# Altium schematic sheet MAIN.SchDoc: Voodoo Magic
size 431 x 279 mm; CheckedBy: Wuji Zhang & Chen Chen; Author: Wuji Zhang & Chen Chen; CompanyName: Upenn; DrawnBy: Wuji Zhang & Chen Chen; Engineer: Wuji Zhang & Chen Chen; Organization: ORGANIZATION; Address1: ADDRESS 1; Address2: ADDRESS 2; Address3: ADDRESS 3; Address4: ADDRESS 4; Revision: -; SheetNumber: 1; SheetTotal: 8; Title2: Main; Project: ESE516; ENG_APP_DATE: --/--/--; DSN_APP_DATE: --/--/--; CHK_APP_DATE: --/--/--
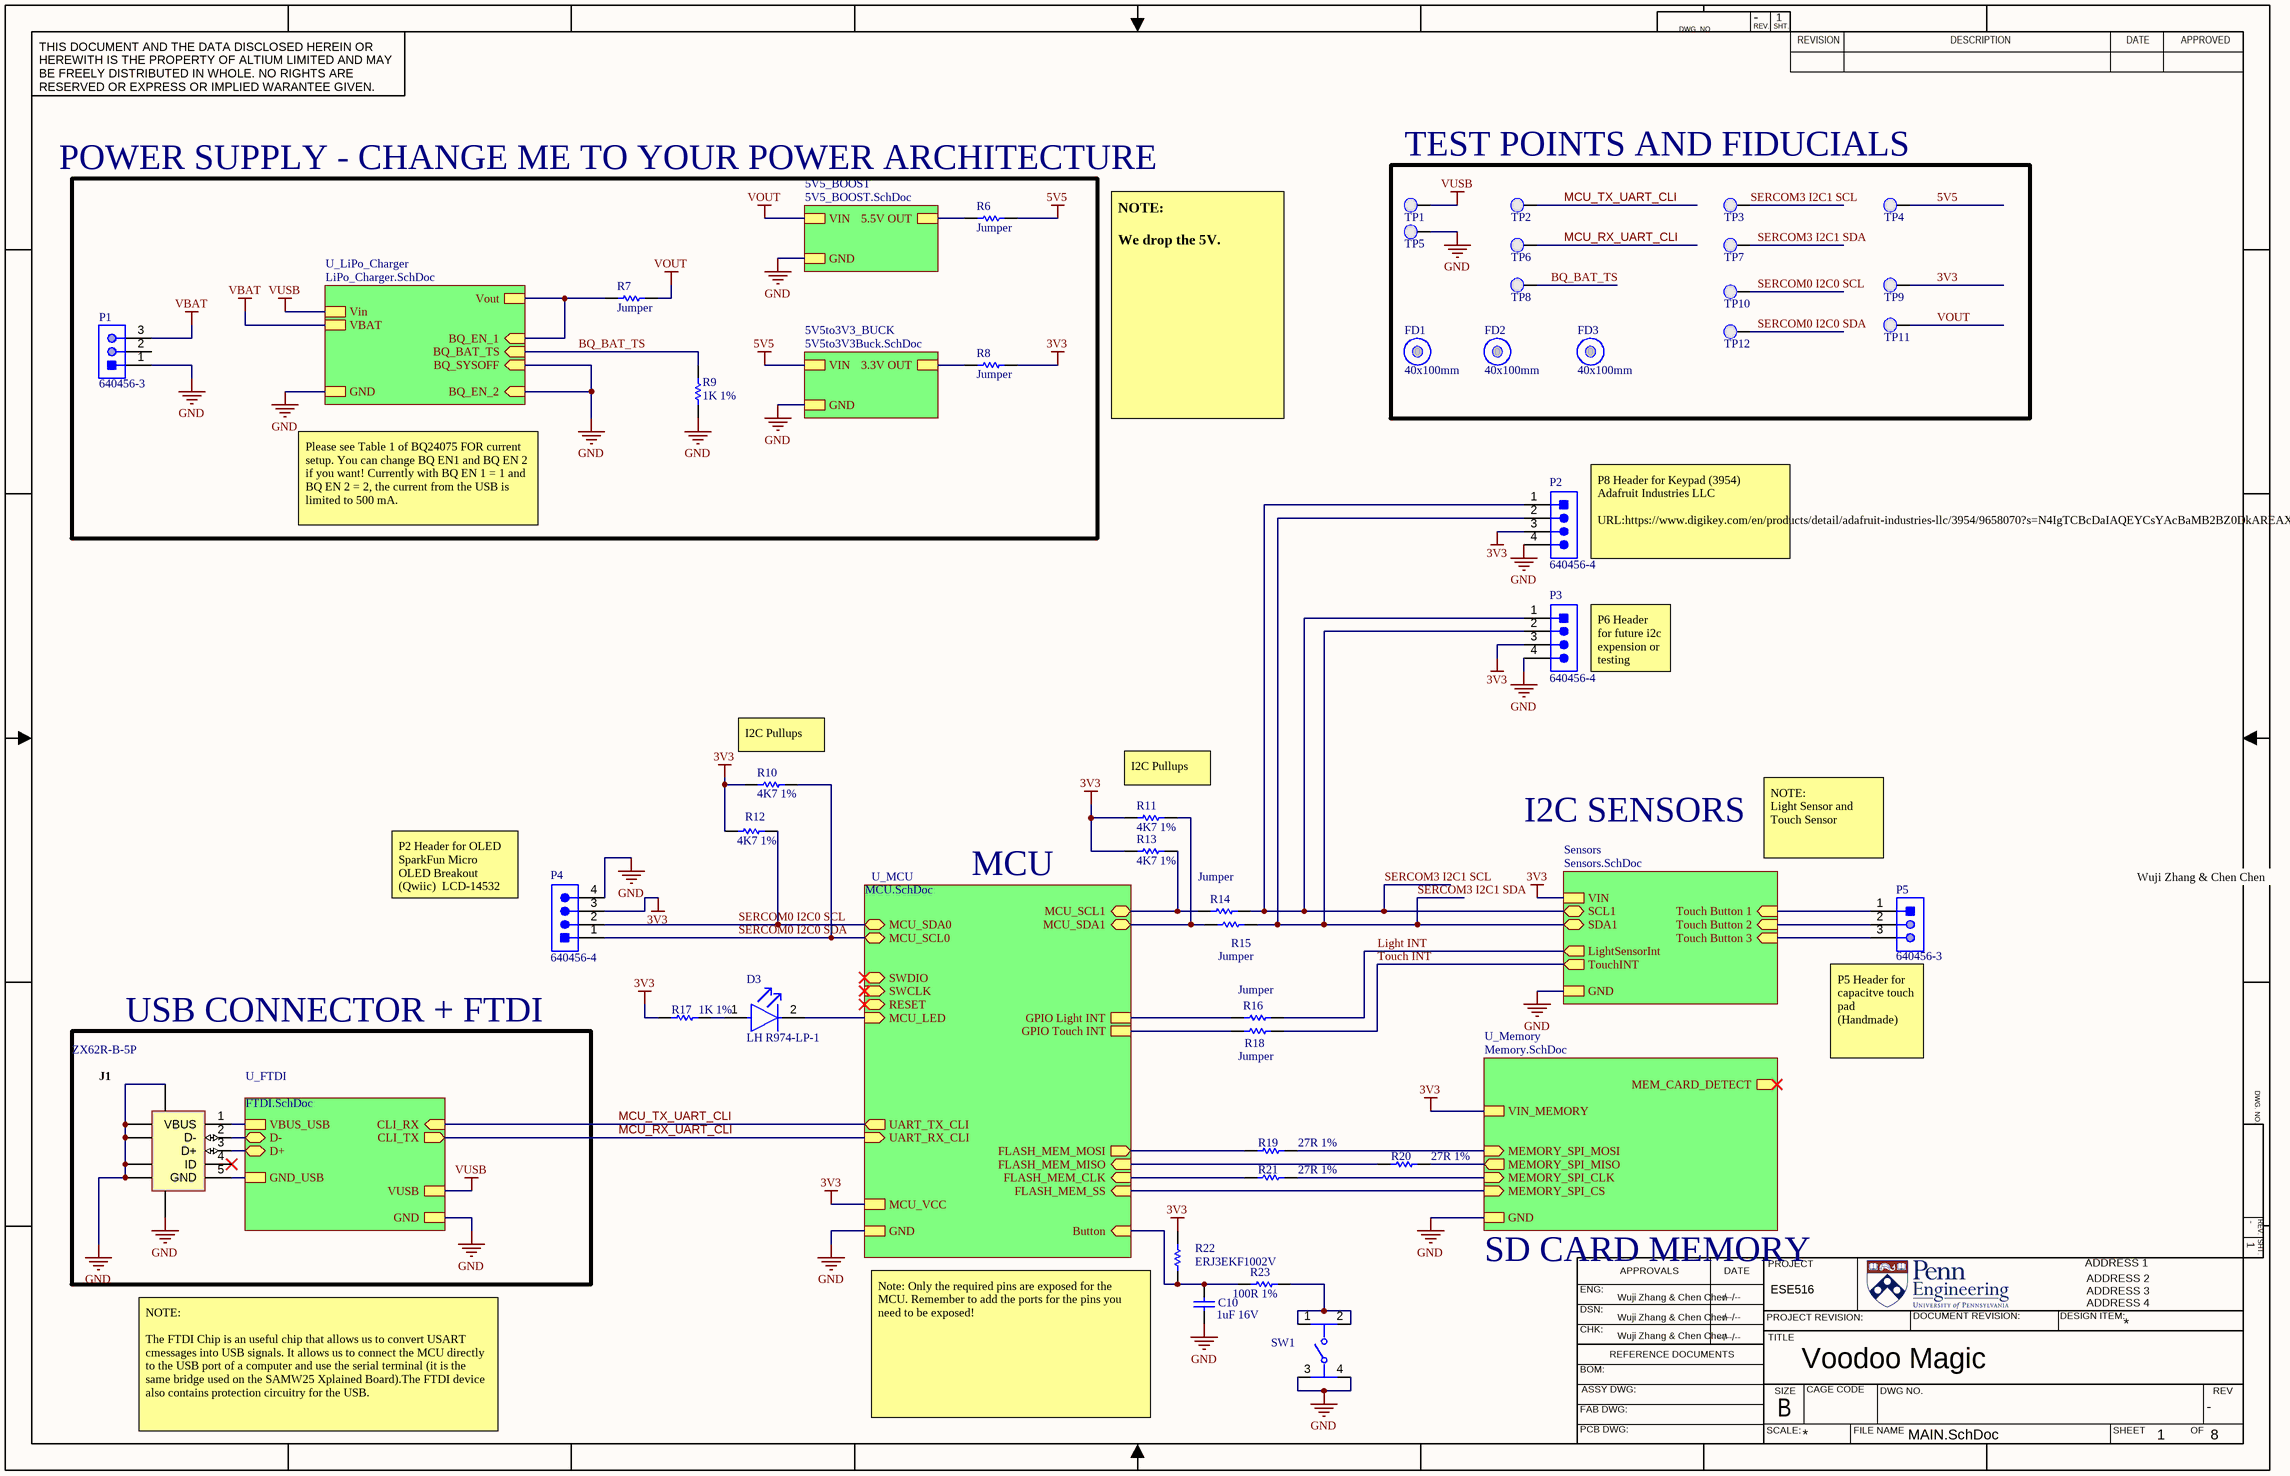
[diagram p0: MAIN.SchDoc]

## Parts
C10  1uF 16V  [CAPC0603(1608)100_N]
D3  LH R974-LP-1  [FP-LH_R974-MFG]
FD1  40x100mm  [Fiducial_FT]
FD2  40x100mm  [Fiducial_FT]
FD3  40x100mm  [Fiducial_FT]
J1  ZX62R-B-5P  [HIRO-ZX62R-B-5P_V]
P1  640456-3  [TECO-640456-3]
P2  640456-4  [TECO-640456-4]
P3  640456-4  [TECO-640456-4]
P4  640456-4  [TECO-640456-4]
P5  640456-3  [TECO-640456-3]
R6  Jumper  [RESC0805(2012)_N]
R7  Jumper  [RESC0805(2012)_N]
R8  Jumper  [RESC0805(2012)_N]
R9  1K 1%  [RESC0603(1608)_N]
R10  4K7 1%  [RESC0402(1005)_N]
R11  4K7 1%  [RESC0402(1005)_N]
R12  4K7 1%  [RESC0402(1005)_N]
R13  4K7 1%  [RESC0402(1005)_N]
R14  Jumper  [RESC0805(2012)_N]
R15  Jumper  [RESC0805(2012)_N]
R16  Jumper  [RESC0805(2012)_N]
R17  1K 1%  [RESC0603(1608)_N]
R18  Jumper  [RESC0805(2012)_N]
R19  27R 1%  [RESC0603(1608)_N]
R20  27R 1%  [RESC0603(1608)_N]
R21  27R 1%  [RESC0603(1608)_N]
R22  ERJ3EKF1002V  [RESC1609X55X30LL15T15]
R23  100R 1%  [RESC0603(1608)_N]
SW1  PTS810 SJG 250 SMTR LFS  [FP-PTS810_SJG_250_SMTR_LF-MFG]  (value not drawn)
TP1  0.1" Pad  [PCBComponent]  (value not drawn)
TP2  0.1" Pad  [PCBComponent]  (value not drawn)
TP3  0.1" Pad  [PCBComponent]  (value not drawn)
TP4  0.1" Pad  [PCBComponent]  (value not drawn)
TP5  0.1" Pad  [PCBComponent]  (value not drawn)
TP6  0.1" Pad  [PCBComponent]  (value not drawn)
TP7  0.1" Pad  [PCBComponent]  (value not drawn)
TP8  0.1" Pad  [PCBComponent]  (value not drawn)
TP9  0.1" Pad  [PCBComponent]  (value not drawn)
TP10  0.1" Pad  [PCBComponent]  (value not drawn)
TP11  0.1" Pad  [PCBComponent]  (value not drawn)
TP12  0.1" Pad  [PCBComponent]  (value not drawn)

## Blocks framed on the sheet
TEST POINTS AND FIDUCIALS: FD1-FD3 TP1-TP12
USB CONNECTOR + FTDI: J1

## Sub-sheets
5V5_BOOST = 5V5_BOOST.SchDoc: VIN, 5.5V OUT, GND
5V5to3V3_BUCK = 5V5to3V3Buck.SchDoc: VIN, 3.3V OUT, GND
Sensors = Sensors.SchDoc: VIN, SCL1 (bidir), SDA1 (bidir), TouchINT (out), LightSensorInt (out), GND, Touch Button 1 (in), Touch Button 2 (in), Touch Button 3 (in)
U_FTDI = FTDI.SchDoc: CLI_RX (in), CLI_TX (out), VUSB, GND, VBUS_USB, D- (bidir), D+ (bidir), GND_USB
U_LiPo_Charger = LiPo_Charger.SchDoc: BQ_EN_2 (in), BQ_SYSOFF (in), BQ_EN_1 (in), BQ_BAT_TS (in), Vin, Vout, GND, VBAT
U_MCU = MCU.SchDoc: SWDIO (bidir), SWCLK (in), UART_TX_CLI (out), UART_RX_CLI (in), FLASH_MEM_SS (in), FLASH_MEM_CLK (in), FLASH_MEM_MISO (in), FLASH_MEM_MOSI (out), RESET (bidir), MCU_LED (in), MCU_VCC, GND, MCU_SCL1 (bidir), MCU_SDA1 (bidir), GPIO Light INT, GPIO Touch INT, Button (in), MCU_SCL0 (bidir), MCU_SDA0 (bidir)
U_Memory = Memory.SchDoc: MEMORY_SPI_MOSI (in), MEMORY_SPI_MISO (out), MEMORY_SPI_CLK (in), MEMORY_SPI_CS (in), MEM_CARD_DETECT (out), VIN_MEMORY, GND

## Nets
3V3: P2.3 P3.3 P4.3 R8.2 R10.2 R11.2 R12.2 R13.2 R17.1 R22.2 TP9.1(PAD) ; sheet U_MCU/MCU_VCC, sheet U_Memory/VIN_MEMORY, sheet Sensors/VIN
5V5: R6.2 TP4.1(PAD) ; sheet 5V5to3V3_BUCK/VIN
GND: C10.1 J1.6(SHLD) J1.7(SHLD) J1.8(SHLD) J1.9(SHLD) J1.10(SHLD) J1.11(SHLD) P1.1 P2.4 P3.4 P4.4 R9.2 SW1.3 SW1.4 TP5.1(PAD) ; sheet U_FTDI/GND, sheet U_MCU/GND, sheet U_Memory/GND, sheet U_LiPo_Charger/BQ_EN_2, sheet U_LiPo_Charger/BQ_SYSOFF, sheet U_LiPo_Charger/GND, sheet 5V5_BOOST/GND, sheet 5V5to3V3_BUCK/GND, sheet Sensors/GND
VBAT: P1.3 ; sheet U_LiPo_Charger/VBAT
VOUT: R7.2 TP11.1(PAD) ; sheet 5V5_BOOST/VIN
VUSB: TP1.1(PAD) ; sheet U_FTDI/VUSB, sheet U_LiPo_Charger/Vin
BQ_BAT_TS: R9.1 TP8.1(PAD) ; sheet U_LiPo_Charger/BQ_BAT_TS
Light INT: R16.2 ; sheet Sensors/LightSensorInt
MCU_RX_UART_CLI: TP6.1(PAD) ; sheet U_FTDI/CLI_TX, sheet U_MCU/UART_RX_CLI
MCU_TX_UART_CLI: TP2.1(PAD) ; sheet U_FTDI/CLI_RX, sheet U_MCU/UART_TX_CLI
SERCOM0 I2C0 SCL: P4.2 R12.1 TP10.1(PAD) ; sheet U_MCU/MCU_SDA0
SERCOM0 I2C0 SDA: P4.1 R10.1 TP12.1(PAD) ; sheet U_MCU/MCU_SCL0
SERCOM3 I2C1 SCL: P2.1 P3.1 R14.2 TP3.1(PAD) ; sheet Sensors/SCL1
SERCOM3 I2C1 SDA: P2.2 P3.2 R15.2 TP7.1(PAD) ; sheet Sensors/SDA1
Touch INT: R18.2 ; sheet Sensors/TouchINT
NetC10_2: C10.2 R22.1 R23.1 ; sheet U_MCU/Button
NetD3_1: D3.1(A) R17.2
NetD3_2: D3.2(C) ; sheet U_MCU/MCU_LED
NetJ1_1: J1.1(VBUS) ; sheet U_FTDI/VBUS_USB
NetJ1_2: J1.2(D-) ; sheet U_FTDI/D-
NetJ1_3: J1.3(D+) ; sheet U_FTDI/D+
NetJ1_5: J1.5(GND) ; sheet U_FTDI/GND_USB
NetP5_1: P5.1 ; sheet Sensors/Touch Button 1
NetP5_2: P5.2 ; sheet Sensors/Touch Button 2
NetP5_3: P5.3 ; sheet Sensors/Touch Button 3
NetR6_1: R6.1 ; sheet 5V5_BOOST/5.5V OUT
NetR7_1: R7.1 ; sheet U_LiPo_Charger/BQ_EN_1, sheet U_LiPo_Charger/Vout
NetR8_1: R8.1 ; sheet 5V5to3V3_BUCK/3.3V OUT
NetR11_1: R11.1 R15.1 ; sheet U_MCU/MCU_SDA1
NetR13_1: R13.1 R14.1 ; sheet U_MCU/MCU_SCL1
NetR16_1: R16.1 ; sheet U_MCU/GPIO Light INT
NetR18_1: R18.1 ; sheet U_MCU/GPIO Touch INT
NetR19_1: R19.1 ; sheet U_MCU/FLASH_MEM_MOSI
NetR19_2: R19.2 ; sheet U_Memory/MEMORY_SPI_MOSI
NetR20_1: R20.1 ; sheet U_MCU/FLASH_MEM_MISO
NetR20_2: R20.2 ; sheet U_Memory/MEMORY_SPI_MISO
NetR21_1: R21.1 ; sheet U_MCU/FLASH_MEM_CLK
NetR21_2: R21.2 ; sheet U_Memory/MEMORY_SPI_CLK
NetR23_2: R23.2 SW1.1 SW1.2
(unnamed): sheet U_MCU/FLASH_MEM_SS, sheet U_Memory/MEMORY_SPI_CS

Not connected (* = marked no-connect by the designer): J1 4(ID)*; P1 2

## Notes on the sheet
- (near R6) POWER SUPPLY - CHANGE ME TO YOUR POWER ARCHITECTURE
- NOTE:
  We drop the 5V.
- Please see Table 1 of BQ24075 FOR current setup. You can change BQ EN1 and BQ EN 2 if you want! Currently with BQ EN 1 = 1 and BQ EN 2 = 2, the current from the USB is limited to 500 mA.
- (near P2) P8 Header for Keypad (3954) Adafruit Industries LLC
  URL:https://www.digikey.com/en/products/detail/adafruit-industries-llc/3954/9658070?s=N4IgTCBcDaIAQEYCsYAcBaMB2BZ0DkAREAXQF8g
- (near P3) P6 Header for future i2c expension or testing
- (near R10) I2C Pullups
- (near R11) I2C Pullups
- I2C SENSORS
- P2 Header for OLED
  SparkFun Micro OLED Breakout (Qwiic)  LCD-14532
- MCU
- NOTE:
  Light Sensor and Touch Sensor
- Wuji Zhang & Chen Chen
- (near P5) P5 Header for capacitve touch pad (Handmade)
- SD CARD MEMORY
- NOTE:
  The FTDI Chip is an useful chip that allows us to convert USART cmessages into USB signals. It allows us to connect the MCU directly to the USB port of a computer and use the serial terminal (it is the same bridge used on the SAMW25 Xplained Board).The FTDI device also contains protection circuitry for the USB.
- (near R22) Note: Only the required pins are exposed for the MCU. Remember to add the ports for the pins you need to be exposed!
- DWG. NO.
- REV.
- SHT.
- THIS DOCUMENT AND THE DATA DISCLOSED HEREIN OR HEREWITH IS THE PROPERTY OF ALTIUM LIMITED AND MAY BE FREELY DISTRIBUTED IN WHOLE. NO RIGHTS ARE RESERVED OR EXPRESS OR IMPLIED WARANTEE GIVEN.
- REVISION
- DESCRIPTION
- DATE
- APPROVED
- ENG:
- APPROVALS
- PROJECT
- DSN:
- CHK:
- REFERENCE DOCUMENTS
- PROJECT REVISION:
- TITLE
- DOCUMENT REVISION:
- DESIGN ITEM:
- BOM:
- FAB DWG:
- PCB DWG:
- ASSY DWG:
- SCALE:
- SIZE
- B
- CAGE CODE
- FILE NAME
- DWG NO.
- SHEET
- OF
- REV

## Library data of the parts
C10 = CMP-1035-02736-1: CAP 1uF 16V ±5% 0603 (1608 Metric) Thickness 1mm SMD; Case-Metric: 1608; Case-EIA: 0603; Tolerance: Â±5%; Technology: SMT; Max Thickness: 1 mm; Rated Voltage: 16 V; Value: 1uF
D3 = CMP-2000-06540-2: LED RED DIFFUSED 0805 SMD; Number of Elements: 1; Forward Voltage: 2.6V; Viewing Angle: 160°; Reverse Voltage: 5V; Test Current: 20mA; Dominant Wavelength: 645nm; Forward Current: 30mA; Luminous Intensity: 15mcd; Depth: 1.35mm; Min Operating Temperature: -30°C; Length: 2.1mm; Max Operating Temperature: 85°C; Radiation Hardening: No; Packaging: Tape and Reel; Number of Pins: 2; Mount: Surface Mount; Lens Style: Diffused
FD1-FD3 = CMP-00174-A.4: Fiducial 40x100mm
J1 = CMP-0031-00001-1: Connector; USBMicro-B,Reverse type, SMT; 5 Position; Right Angle; DatasheetVersion: 08/2010; Operating Temperature: -30 to 85 degC; Mounting Technology: Surface Mount; PartNumber: ZX62R-B-5P; PackageReference: ZX62R-B-5P; ComponentLink2URL: http://www.hirose.co.jp/cataloge_hp/e24200011.pdf; ComponentLink1URL: http://www.hirose.com/â€Ž; ComponentLink2Description: Datasheet; PackageDescription: 5-Pin USB Micro-B R/A Connector; ComponentLink1Description: Manufacturer URL
P1 P5 = CMP-2000-05418-1: Male Header, Pitch 2.54 mm, 1 x 3 Position, Height 10.03 mm, Tail Length 3.56 mm, -55 to 105 degC; Manufacturer: TE Connectivity; Agency Approvals: CSA,UL; Angle: Straight; Number of Positions: 3; Standards: RoHSCompliant,ELVCompliant,UL94V-0; Current, Rating: 5 / A; Connector Type: MTA-100; Mount Angle: Vertical; Material, Housing: Polyester; Temperature, Operating: -55to+105 / degC; Voltage, Rating: 250 / V; Color, Housing: White; Contact Centerline Spacing: 0.100 / in.; Special Features: Pinstrip; Material, Contact: CopperAlloy; Contact Termination Area Plating: Tin; Primary Type: InterconnectSystem; Pin Spacing: 0.1 / "; Brand/Series: MTA-100Series; Mounting Hole Size: 0.04 / "; Manufacturer URL: http://www.te.com/; Datasheet URL: https://datasheet.ciiva.com/16456/eng-ds-82056-mta-0608-16456886.pdf; Flammability Rating: UL94V-0; Mounting Type: PCMount; Contact Mating Area Plating: Tin; Datasheet Version: Jun-08; Number of Rows: 1; Termination: Solder; Type: PCBPlug; Length, Pin: 0.14 / "; Color: White; Contact Plating: Tin; Contact Shape: Square; Number of Contacts: 3; Size, Post: 0.025 / in.; Length, Terminal Post: 0.14 / in.; Length, Overall: 0.3 / "
P2-P4 = CMP-2000-05419-1: Male Header, Pitch 2.54 mm, 1 x 4 Position, Height 10.03 mm, Tail Length 3.56 mm, RoHS, Bulk; Manufacturer: TE Connectivity; Material, Housing: Polyester; Primary Type: InterconnectSystem; Mount Angle: Vertical; Color, Housing: White; Current, Rating: 5 / A; Agency Approvals: CSA,UL; Contact Termination Area Plating: Tin; Temperature, Operating: -55to+105 / degC; Standards: RoHSCompliant,ELVCompliant,UL94V-0; Number of Positions: 4; Brand/Series: MTA-100Series; Angle: Straight; Pin Spacing: 0.1 / "; Material, Contact: CopperAlloy; Connector Type: MTA-100; Special Features: Pinstrip; Mounting Hole Size: 0.04 / "; Contact Centerline Spacing: 0.100 / in.; Voltage, Rating: 250 / V; Manufacturer URL: http://www.te.com/; Length, Pin: 0.14 / "; Length, Overall: 0.4 / "; Color: White; Flammability Rating: UL94V-0; Mounting Type: PCMount; Termination: Solder; Datasheet URL: https://datasheet.ciiva.com/16286/eng-ds-82056-mta-0608-16286228.pdf; Number of Contacts: 4; Contact Shape: Square; Contact Mating Area Plating: Tin; Length, Terminal Post: 0.14 / in.; Size, Post: 0.025 / in.; Contact Plating: Tin; Type: PCBPlug; Datasheet Version: Dec-14; Number of Rows: 1
R6-R8 R14-R16 R18 = CMP-1013-00001-1: Jumper 0805 (2012 Metric); Case-EIA: 0805; Value: 0.00 Ohm; Tolerance: None; Case-Metric: 2012; Technology: SMT; Power: None
R9 R17 = CMP-1012-00510-1: 1K 0.1W 1% 0603 (1608 Metric)  SMD; Case-Metric: 1608; Case-EIA: 0603; Value: 1000.00 Ohm; Technology: SMT; Tolerance: 1 %; Power: 0.1 W
R10-R13 = CMP-1011-00586-1: 4K7 0.063W 1% 0402 (1005 Metric)  SMD; Case-Metric: 1005; Value: 4700.00 Ohm; Case-EIA: 0402; Power: 0.063 W; Technology: SMT; Tolerance: 1 %
R19-R21 = CMP-1012-00331-1: 27R 0.1W 1% 0603 (1608 Metric)  SMD; Case-EIA: 0603; Value: 27.00 Ohm; Case-Metric: 1608; Technology: SMT; Tolerance: 1 %; Power: 0.1 W
R22 = CMP-1012-00623-3: Chip Resistor, 10 KOhm, +/- 1%, 0.1 W, -55 to 155 degC, 0603 (1608 Metric), RoHS, Tape and Reel; Manufacturer: Panasonic; Case\/Package: 0603; Max Power Dissipation: 100mW; Resistance: 10KOhm; Temperature Coefficient: 100ppm\/degreesC; Voltage Rating (DC): 75V; Tolerance: 1%; Case Code (Imperial): 0603; Case Code (Metric): 1608; Composition: ThickFilm; Contact Plating: Tin; Datasheet URL: https://industrial.panasonic.com/cdbs/www-data/pdf/RDA0000/AOA0000C304.pdf; Datasheet Version: 02/2017; Depth: 0.8mm; Height: 0.45mm; Lead Free: LeadFree; Length: 1.6mm; Manufacturer URL: http://www.panasonic.com/; Max Operating Temperature: 155degC; Military Standard: Not; Min Operating Temperature: -55degC; Mount: SurfaceMount; Mounting Technology: SurfaceMount; Number of Pins: 2; Number of Terminations: 2; Package Description: 2-Pin Surface Mount Device, Body 1.6 x 0.85 mm; Package Quantity: 1; Package Reference: 603; Packaging: TapeandReel; Power Rating: 100mW; Radiation Hardening: No; REACH SVHC: NoSVHC; RoHSCompliant: true; Termination: SMD/SMT; Voltage Rating: 75V; Width: 0.031inch
R23 = CMP-1012-00397-1: 100R 0.1W 1% 0603 (1608 Metric)  SMD; Value: 100.00 Ohm; Case-EIA: 0603; Case-Metric: 1608; Technology: SMT; Tolerance: 1 %; Power: 0.1 W
SW1 = CMP-10040-000011-1: SWITCH TACTILE SPST-NO 0.05A 16V; Manufacturer: C&K Components; Electromechanical Life: 100000Cycles; Contact Resistance: 500mΩ; Operating Force: 400gf; Current Rating: 50mA; Voltage Rating Dc: 16V; Device Class L2: Switches; Device Class L1: Electromechanical; ComponentLink2URL: https://www.ckswitches.com/media/1476/pts810.pdf; Digikey Description: SWITCH TACTILE SPST-NO 0.05A 16V; RoHS: TRUE; Temperature Range Low: -40°C; Temperature Range High: +85°C; Automotive: No; Category: Switch; ComponentLink2Description: Datasheet; Device Class L3: Tactile Switches; Mouser Description: Switch Tactile N.O. SPST Button J-Bend 0.05A 16VDC 100000Cycles 3.92N SMD T/R; Throw Configuration: SPST-NO; Package: PTS810 SJG 250 SMTR LFS; Height: 2.7mm; Octopart: https://octopart.com/pts810sjg250smtrlfs-c%26k+components-29380277; Manufacturer Part Number: PTS810 SJG 250 SMTR LFS; Temperature: -40°C to +85°C; Lead Free: Yes
TP1-TP12 = 0.1" Pad-A.4